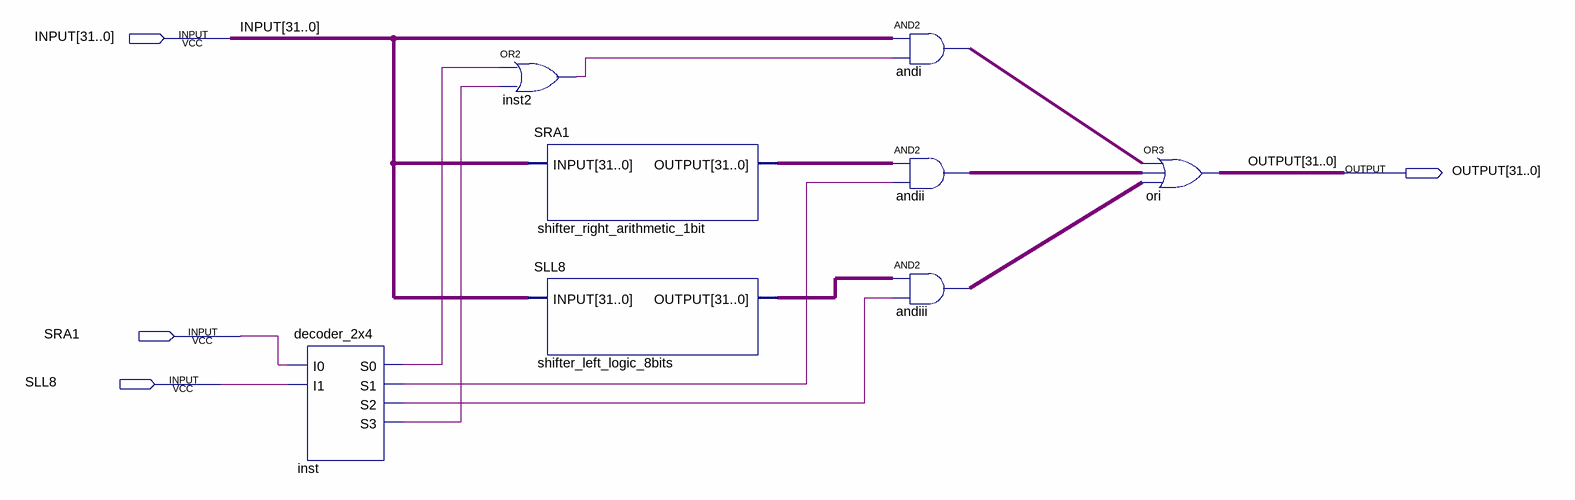
[diagram p0: schematic sheet]
// Quartus schematic shifter.bdf as structural Verilog: 8 symbols, 4 pins
module shifter (
  input  [31:0] INPUT,
  input  SRA1,
  input  SLL8,
  output [31:0] OUTPUT
);

  wire inst2_out, inst_s0, inst_s1, inst_s2, inst_s3;
  wire [31:0] andi_out, andii_out, andiii_out, shifter_left_logic_8bits_output,
       shifter_right_arithmetic_1bit_output;

  decoder_2x4 inst (.I0(SRA1), .I1(SLL8), .S0(inst_s0), .S1(inst_s1), .S2(inst_s2), .S3(inst_s3));
  or inst2 (inst2_out, inst_s0, inst_s3);
  SRA1 shifter_right_arithmetic_1bit (.INPUT(INPUT), .OUTPUT(shifter_right_arithmetic_1bit_output));
  SLL8 shifter_left_logic_8bits (.INPUT(INPUT), .OUTPUT(shifter_left_logic_8bits_output));
  assign andi_out = INPUT & {32{inst2_out}};  // AND2 andi, 32 bits wide
  assign andii_out = shifter_right_arithmetic_1bit_output & {32{inst_s1}};  // AND2 andii, 32 bits wide
  assign andiii_out = shifter_left_logic_8bits_output & {32{inst_s2}};  // AND2 andiii, 32 bits wide
  assign OUTPUT = andi_out | andii_out | andiii_out;  // OR3 ori, 32 bits wide
endmodule
